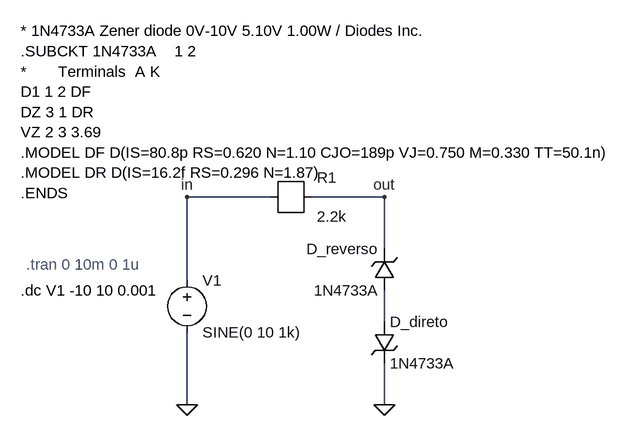
[diagram p0: schematic lab_eletronicos_1_2.asc]
lab_eletronicos_1_2.asc, the LTspice schematic file:
Version 4
SHEET 1 1492 784
WIRE 336 208 208 208
WIRE 512 208 400 208
WIRE 512 288 512 208
WIRE 208 336 208 208
WIRE 512 400 512 352
WIRE 208 528 208 416
WIRE 512 528 512 464
FLAG 208 528 0
FLAG 512 528 0
FLAG 208 208 in
FLAG 512 208 out
SYMBOL r 336 208 R0
SYMATTR InstName R1
SYMATTR Value 2.2k
SYMBOL voltage 208 320 R0
SYMATTR InstName V1
SYMATTR Value SINE(0 10 1k)
SYMATTR Value2 AC 5
SYMBOL zener 528 352 R180
WINDOW 0 24 64 Left 2
WINDOW 3 24 0 Left 2
SYMATTR InstName D_reverso
SYMATTR Value 1N4733A
SYMATTR Prefix X
SYMBOL zener 496 400 R0
SYMATTR InstName D_direto
SYMATTR Value 1N4733A
SYMATTR Prefix X
TEXT -48 352 Left 2 !.dc V1 -10 10 0.001
TEXT -40 312 Left 2 ;.tran 0 10m 0 1u
TEXT -48 -48 Left 2 !* 1N4733A Zener diode 0V-10V 5.10V 1.00W / Diodes Inc.\n.SUBCKT 1N4733A    1 2\n*       Terminals  A K\nD1 1 2 DF\nDZ 3 1 DR\nVZ 2 3 3.69\n.MODEL DF D(IS=80.8p RS=0.620 N=1.10 CJO=189p VJ=0.750 M=0.330 TT=50.1n)\n.MODEL DR D(IS=16.2f RS=0.296 N=1.87)\n.ENDS

The netlist it stands for:
* lab_eletronicos_1_2.asc
R1 out in 2.2k
V1 in 0 SINE(0 10 1k) AC 5
XD_reverso N001 out 1N4733A  ; pins + -
XD_direto N001 0 1N4733A  ; pins + -
.dc V1 -10 10 0.001
* .tran 0 10m 0 1u
* 1N4733A Zener diode 0V-10V 5.10V 1.00W / Diodes Inc.
.SUBCKT 1N4733A    1 2
*       Terminals  A K
D1 1 2 DF
DZ 3 1 DR
VZ 2 3 3.69
.MODEL DF D(IS=80.8p RS=0.620 N=1.10 CJO=189p VJ=0.750 M=0.330 TT=50.1n)
.MODEL DR D(IS=16.2f RS=0.296 N=1.87)
.ENDS
.backanno
.end